# EAGLE design utilidong-lipo-charger-mk-1.0 (EAGLE 6.5.0)
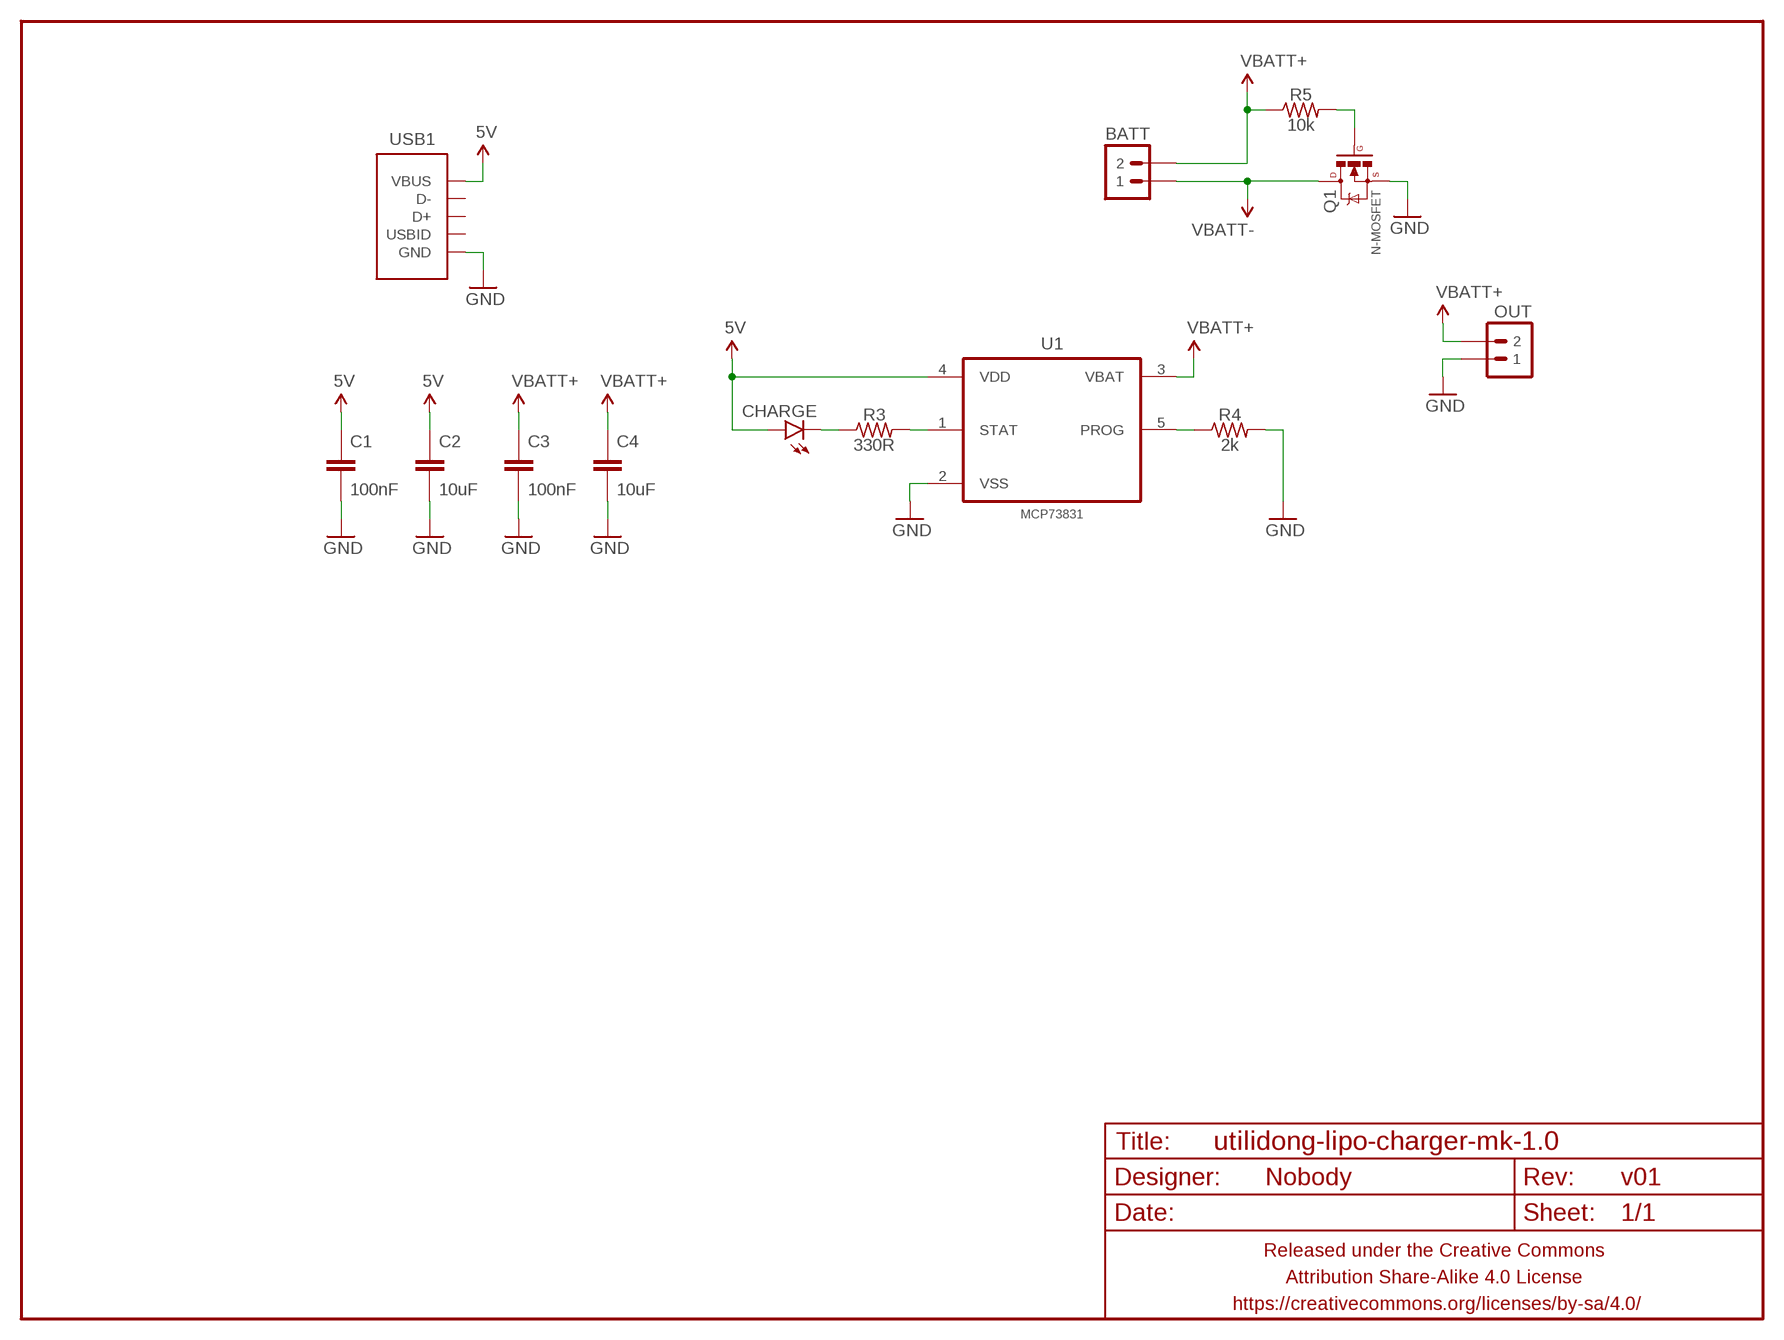
[diagram p0: schematic, sheet 1]

## Parts
BATT  M02PTH-CENTERED-R+  [1X02-CENTER-R+]
C1  100nF  CAPACITOR-CERAMICC0805  [C0805]
C2  10uF  CAPACITOR-CERAMICC1206  [C1206]
C3  100nF  CAPACITOR-CERAMICC0805  [C0805]
C4  10uF  CAPACITOR-CERAMICC1206  [C1206]
CHARGE  LED1206  [LED-1206]
FRAME1  FRAME-LETTERNO_PACKAGE  [DUMMY]
OUT  M02PTH-CENTERED-R+  [1X02-CENTER-R+]
Q1  N-MOSFET  MOSFET-NCHANNELBSS138  [SOT23]
R3  330R  RESISTORR0805  [R0805]
R4  2k  RESISTORR0805  [R0805]
R5  10k  RESISTORR0805  [R0805]
U1  MCP73831  MCP73831T-2ACI/OT  [SOT95P280X145-5N]
USB1  USB-ABCOMBO  [USB-MICRO-B-FCI-CUTOUT]

## Nets
5V: C1.1 C2.1 CHARGE.A U1.4(VDD) USB1.1(VBUS)
GND: C1.2 C2.2 C3.2 C4.2 OUT.1 Q1.2(S) R4.2 U1.2(VSS) USB1.5(GND) USB1.P$1(GND) USB1.P$2(GND)
N$5: R3.2 U1.1(STAT)
N$6: CHARGE.C R3.1
N$8: R4.1 U1.5(PROG)
N$11: Q1.1(G) R5.2
VBATT+: BATT.2 C3.1 C4.1 OUT.2 R5.1 U1.3(VBAT)
VBATT-: BATT.1 Q1.3(D)
Unconnected: USB1.2(D-) USB1.3(D+) USB1.4(USBID)

## Library data of the parts
BATT OUT = A_butts:M02: Standard 2-pin 0.1" header. Use with - straight break away headers ( PRT-00116) - right angle break away headers (PRT-00553) - swiss pins (PRT-00743) - machine pins (PRT-00117) - female headers (PRT-00115) Molex polarized connector foot print use with: PRT-08233 with associated crimp pins and housings. 2.54_SCREWTERM for use with PRT-10571. 3.5mm Screw Terminal footprints for PRT-08084 5mm Screw Terminal footprints for use with PRT-08433
C1-C4 = A_butts:CAPACITOR-CERAMIC: CAPACITOR, European symbol
CHARGE = A_butts:LED: LEDs Standard schematic elements and footprints for 5mm, 3mm, 1206, and 0603 sized LEDs. 5mm - Spark Fun Electronics SKU : COM-00529 (and others)
FRAME1 = A_butts:FRAME-LETTER: Schematic Frame Standard 8.5x11 US Letter frame; DESIGNER: Nobody; VERSION: v01
Q1 = A_butts:MOSFET-NCHANNEL: Common NMOSFET Parts MFG P/N Store ID Prod ID FDD8780 TRANS-09984 SI7820DN TRANS-11055 FDS6630A IC-08089 2N7002PW TRANS-11151 FQP30N06L COM-10213 TRANS-10060 BSS123LT1G TRANS-08345 BSS138 TRANS-00830 BS170 2N7000; PROD_ID: TRANS-00830
R3-R5 = A_butts:RESISTOR: RESISTOR, American symbol
U1 = A_butts:MCP73831T-2ACI/OT: Charge Management Controller; MPN: MCP73831T-2ACI/OT; OC_FARNELL: 1332158; OC_NEWARK: 56K7045; PACKAGE: SOT-5; SUPPLIER: Microchip
USB1 = A_butts:USB-AB: This is a USB AB connector that is compatible with USB OTG. i.e. this connector can serve as a host or device

## Board
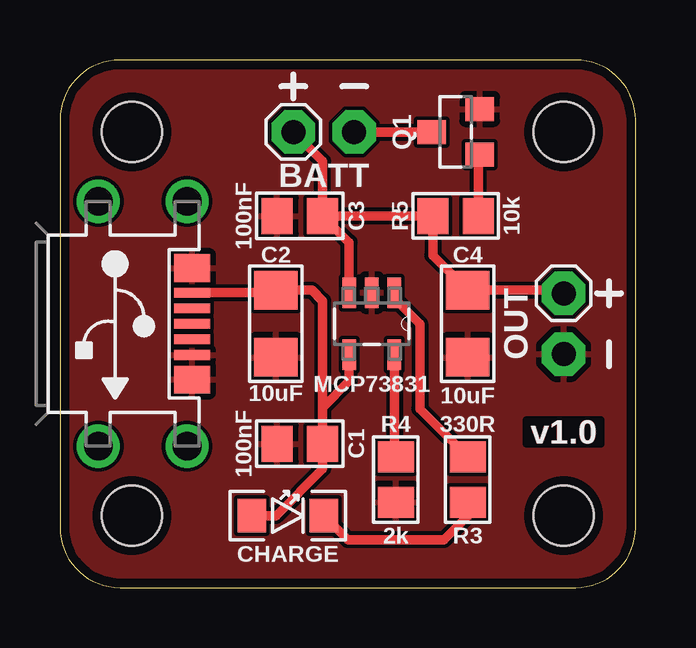
[diagram p1: board, top side]
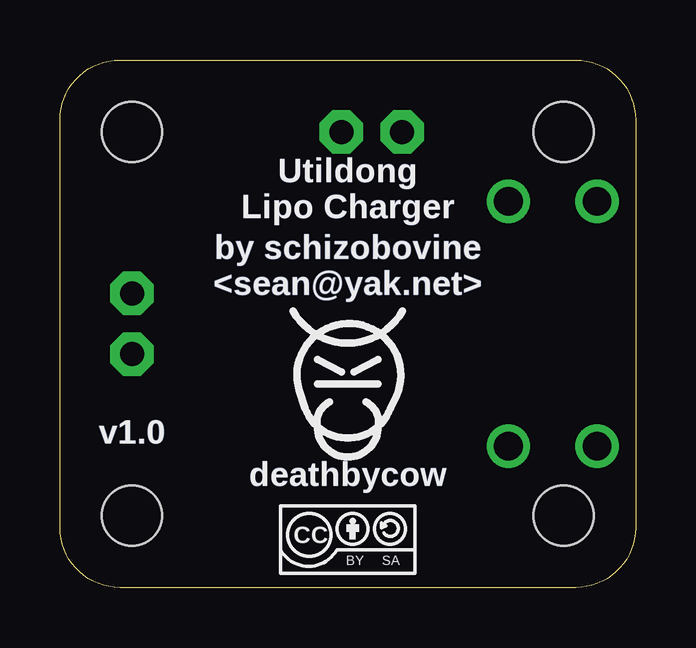
[diagram p2: board, bottom side, seen from below]

Size 24 x 22 mm. Coordinates in mm from the lower left corner, seen from the top.
Outline: 0,19.5 0,2.5 arc90 2.5,0 21.5,0 arc90 24,2.5 24,19.5 arc90 21.5,22 2.5,22 arc90 0,19.5
Copper layers (1*16): Top 0.0356mm / dielectric 1.5011mm / Bottom 0.0356mm
Design rules "LaenPCBOrder_2": minimum track width 6mil, minimum drill 13mil, track to track 6mil, track to pad 6mil, pad to pad 6mil, via to via 6mil, smd to smd 6mil, copper to edge 15mil, drill to drill 6mil, minimum pad ring 7mil, minimum via ring 7mil, stop-mask expansion 3mil, vias tented up to drill 20mil, thermal gap 10mil
Holes 2.5 mm at 3,19 3,3 21,3 21,19

### Footprints (pad centres in the part's own frame; a part is rotated, then mirrored left to right if it is on the bottom)
1X02-CENTER-R+ = drill 1 pad 1.8 octagon: 1 -1.27,0; 2 1.27,0
C0805 = smd 1.3 x 1.5: 1 -0.95,0; 2 0.95,0
C1206 = smd 1.6 x 1.8: 1 -1.4,0; 2 1.4,0
LED-1206 = smd 1.2 x 1.4: A -1.5,0; C 1.5,0
SOT23 = smd 1 x 1.2: 1 -0.95,-1; 2 0.95,-1; 3 0,1
R0805 = smd 1.3 x 1.5: 1 -0.95,0; 2 0.95,0
SOT95P280X145-5N = smd 1.27 x 0.559: 1 -1.295,0.94; 2 -1.295,0; 3 -1.295,-0.94; 4 1.295,-0.94; 5 1.295,0.94
USB-MICRO-B-FCI-CUTOUT = smd 0.4 x 1.5: 1 -1.3,0; 2 -0.65,0; 3 0,0; 4 0.65,0; 5 1.3,0 | smd 1.15 x 1.5: P$1 -2.325,0; P$2 2.325,0 | drill 1.2: P$3 -5.1,-0.2; P$4 5.1,-0.2; P$5 -5.1,-3.9; P$6 5.1,-3.9

### Placement (x,y rotation side)
BATT  11,19 180 top
C1  10,6 180 top
C2  9,11 270 top
C3  10,15.5 180 top
C4  17,11 270 top
CHARGE  9.5,3 0 top
FRAME1  0,0 0 top
OUT  21,11 90 top
Q1  16.5,19 90 top
R3  17,4.5 90 top
R4  14,4.5 270 top
R5  16.5,15.5 0 top
U1  13,11 270 top
U$8  [CC-BY-SA-4.0-NO-URL]  12,2 0 bottom
U$9  [COW_SMALL_METAL]  12,9 0 bottom
USB1  5.5,11 270 top

### Tracks (layer width: path | path; a pad name or v marks a point on that pad's centre or on a via)
5V
  Top 0.4: USB1.1 8.9,12.3 C2.1 10.5,12.4 10.95,11.95 10.95,7.5 | 10.95,7.5 C1.1 10.95,4.95 9,3 CHARGE.A | U1.4 12.06,8.61 10.95,7.5
GND
  pour Top: -0.1,-0.1 -0.1,22.1 24.1,22.1 24.1,-0.1
N$5
  Top 0.4: U1.1 13.94,12.06 15,11 15,7.45 R3.2
N$6
  Top 0.4: R3.1 17,3 16,2 12,2 CHARGE.C
N$8
  Top 0.4: 13.94,6.01 13.96,5.79 | 13.96,5.79 R4.1 | U1.5 13.94,5.81 13.96,5.79
N$11
  Top 0.4: R5.2 17.45,18 Q1.1
VBATT+
  Top 0.4: U1.3 12.06,14.39 C3.1 | C3.1 10.95,17.78 BATT.2 | C3.1 R5.1 15.55,13.85 C4.1 20.87,12.4 OUT.2
VBATT-
  Top 0.4: BATT.1 Q1.3

### Text on the board
Bottom: Utildong / Lipo Charger | by schizobovine / <sean@yak.net>
bPlace: Utildong / Lipo Charger | by schizobovine / <sean@yak.net>